# EAGLE design Proto_V1 (EAGLE 9.5.0)
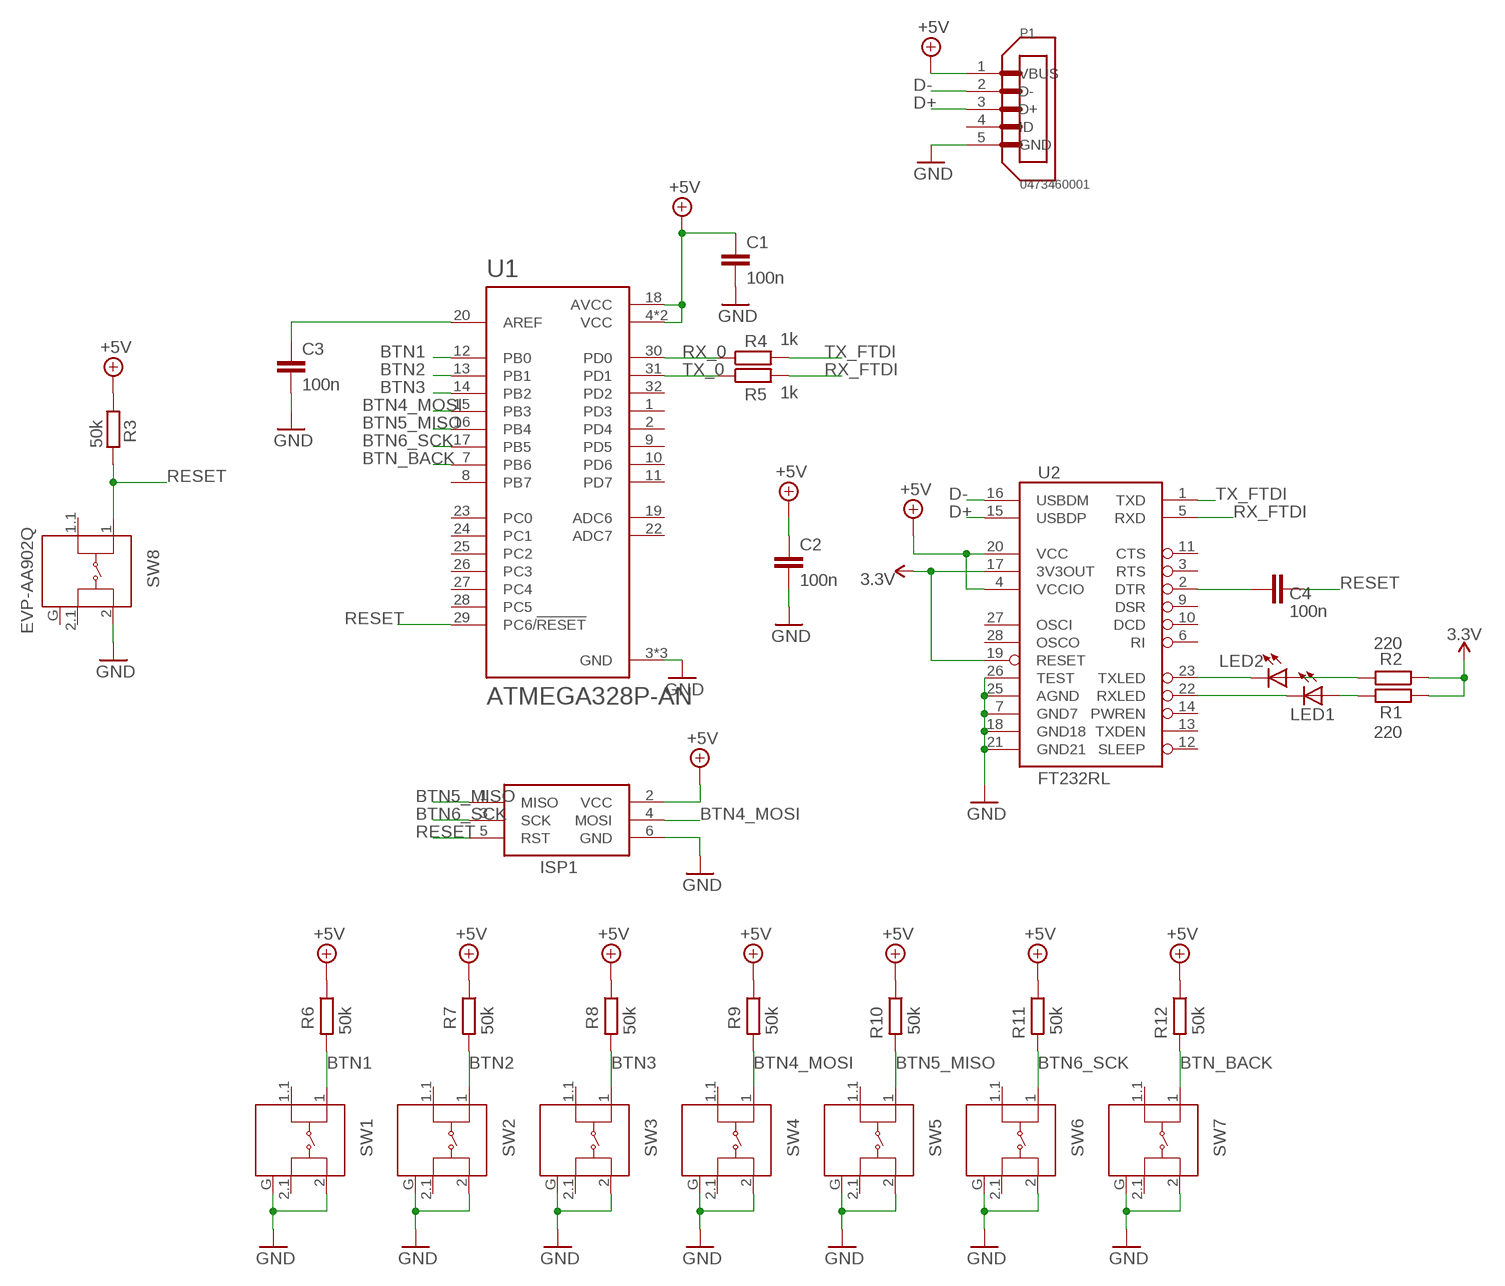
[diagram p0: schematic, sheet 1]

## Parts
C1  100n  CC0805KRX7R9BB104  [CAP_0805]
C2  100n  CC0805KRX7R9BB104  [CAP_0805]
C3  100n  CC0805KRX7R9BB104  [CAP_0805]
C4  100n  CC0805KRX7R9BB104  [CAP_0805]
ISP1  AVRISP-6  [AVRISP]
LED1  LEDCHIP-LED0805  [CHIP-LED0805]
LED2  LEDCHIP-LED0805  [CHIP-LED0805]
P1  0473460001  [MOLEX_0473460001]
R1  220  R-EU_R0805  [R0805]
R2  220  R-EU_R0805  [R0805]
R3  50k  R-EU_R0805  [R0805]
R4  1k  R-EU_R0805  [R0805]
R5  1k  R-EU_R0805  [R0805]
R6  50k  R-EU_R0805  [R0805]
R7  50k  R-EU_R0805  [R0805]
R8  50k  R-EU_R0805  [R0805]
R9  50k  R-EU_R0805  [R0805]
R10  50k  R-EU_R0805  [R0805]
R11  50k  R-EU_R0805  [R0805]
R12  50k  R-EU_R0805  [R0805]
SW1  EVP-AA902Q  [EVP-AA902Q]
SW2  EVP-AA902Q  [EVP-AA902Q]
SW3  EVP-AA902Q  [EVP-AA902Q]
SW4  EVP-AA902Q  [EVP-AA902Q]
SW5  EVP-AA902Q  [EVP-AA902Q]
SW6  EVP-AA902Q  [EVP-AA902Q]
SW7  EVP-AA902Q  [EVP-AA902Q]
SW8  EVP-AA902Q  [EVP-AA902Q]
U1  ATMEGA328P-AN  [QFP80P900X900X120-32N]
U2  FT232RL  FT232RLSSOP  [SSOP28DB]

## Nets
3.3V: R1.1 R2.1 U2.17(3V3OUT) U2.19(RESET)
+5V: C1.1 C2.1 ISP1.2(VCC) P1.1(VBUS) R3.1 R6.1 R7.1 R8.1 R9.1 R10.1 R11.1 R12.1 U1.4(VCC) U1.6(VCC) U1.18(AVCC) U2.4(VCCIO) U2.20(VCC)
BTN1: R6.2 SW1.1 U1.12(PB0)
BTN2: R7.2 SW2.1 U1.13(PB1)
BTN3: R8.2 SW3.1 U1.14(PB2)
BTN4_MOSI: ISP1.4(MOSI) R9.2 SW4.1 U1.15(PB3)
BTN5_MISO: ISP1.1(MISO) R10.2 SW5.1 U1.16(PB4)
BTN6_SCK: ISP1.3(SCK) R11.2 SW6.1 U1.17(PB5)
BTN_BACK: R12.2 SW7.1 U1.7(PB6)
D+: P1.3(D+) U2.15(USBDP)
D-: P1.2(D-) U2.16(USBDM)
GND: C1.2 C2.2 C3.2 ISP1.6(GND) P1.5(GND) SW1.2 SW1.G(SHIELD) SW2.2 SW2.G(SHIELD) SW3.2 SW3.G(SHIELD) SW4.2 SW4.G(SHIELD) SW5.2 SW5.G(SHIELD) SW6.2 SW6.G(SHIELD) SW7.2 SW7.G(SHIELD) SW8.2 U1.3(GND) U1.5(GND) U1.21(GND) U2.7(GND7) U2.18(GND18) U2.21(GND21) U2.25(AGND) U2.26(TEST)
N$1: LED1.A R1.2
N$2: LED2.C U2.23(TXLED)
N$3: LED1.C U2.22(RXLED)
N$4: LED2.A R2.2
N$5: C4.2 U2.2(DTR)
N$6: C3.1 U1.20(AREF)
RESET: C4.1 ISP1.5(RST) R3.2 SW8.1 U1.29(PC6/!RESET)
RX_0: R4.1 U1.30(PD0)
RX_FTDI: R5.2 U2.5(RXD)
TX_0: R5.1 U1.31(PD1)
TX_FTDI: R4.2 U2.1(TXD)
Unconnected: P1.4(ID) SW1.1.1 SW1.2.1 SW2.1.1 SW2.2.1 SW3.1.1 SW3.2.1 SW4.1.1 SW4.2.1 SW5.1.1 SW5.2.1 SW6.1.1 SW6.2.1 SW7.1.1 SW7.2.1 SW8.1.1 SW8.2.1 SW8.G(SHIELD) U1.1(PD3) U1.2(PD4) U1.8(PB7) U1.9(PD5) U1.10(PD6) U1.11(PD7) U1.19(ADC6) U1.22(ADC7) U1.23(PC0) U1.24(PC1) U1.25(PC2) U1.26(PC3) U1.27(PC4) U1.28(PC5) U1.32(PD2) U2.3(RTS) U2.6(RI) U2.9(DSR) U2.10(DCD) U2.11(CTS) U2.12(SLEEP) U2.13(TXDEN) U2.14(PWREN) U2.27(OSCI) U2.28(OSCO)

## Library data of the parts
C1-C4 = Resistor_Capacitor:CC0805KRX7R9BB104: CAP CER 0.1UF 50V X7R 0805 Manufacturer's datasheet <http://www.yageo.com/documents/recent/UPY-GPHC_X7R_6.3V-to-50V_18.pdf>; CREATED_BY: PCBLayout.com; DIGIKEY_PART_NUMBER: 311-1140-2-ND; MANUFACTURER: Yageo; MPN: CC0805KRX7R9BB104; PACKAGE: SMD 0805
ISP1 = adafruit:AVRISP: AVR ISP HEADER Standard 6 pin header for AVR programming
LED1 LED2 = Fidget Spinner Example:LED: LED OSRAM: - CHIPLED LG R971, LG N971, LY N971, LG Q971, LY Q971, LO R971, LY R971 LH N974, LH R974 LS Q976, LO Q976, LY Q976 LO Q996 - Hyper CHIPLED LW Q18S LB Q993, LB Q99A, LB R99A - SideLED LS A670, LO A670, LY A670, LG A670, LP A670 LB A673, LV A673, LT A673, LW A673 LH A674 LY A675 LS A676, LA A676, LO A676, LY A676, LW A676 LS A679, LY A679, LG A679 - Hyper Micro SIDELED® LS Y876, LA Y876, LO Y876, LY Y876 LT Y87S - SmartLED LW L88C, LW L88S LB L89C, LB L89S, LG L890 LS L89K, LO L89K, LY L89K LS L896, LA L896, LO L896, LY L896 - TOPLED LS T670, LO T670, LY T670, LG T670, LP T670 LSG T670, LSP T670, LSY T670, LOP T670, LYG T670 LG T671, LOG T671, LSG T671 LB T673, LV T673, LT T673, LW T673 LH T674 LS T676, LA T676, LO T676, LY T676, LB T676, LH T676, LSB T676, LW T676 LB T67C, LV T67C, LT T67C, LS T67K, LO T67K, LY T67K, LW E67C LS E67B, LA E67B, LO E67B, LY E67B, LB E67C, LV E67C, LT E67C LW T67C LS T679, LY T679, LG T679 LS T770, LO T770, LY T770, LG T770, LP T770 LB T773, LV T773, LT T773, LW T773 LH T774 LS E675, LA E675, LY E675, LS T675 LS T776, LA T776, LO T776, LY T776, LB T776 LHGB T686 LT T68C, LB T68C - Hyper Mini TOPLED® LB M676 - Mini TOPLED Santana® LG M470 LS M47K, LO M47K, LY M47K Source: http://www.osram.convergy.de LUXEON: - LUMILED® LXK2-PW12-R00, LXK2-PW12-S00, LXK2-PW14-U00, LXK2-PW14-V00 LXK2-PM12-R00, LXK2-PM12-S00, LXK2-PM14-U00 LXK2-PE12-Q00, LXK2-PE12-R00, LXK2-PE12-S00, LXK2-PE14-T00, LXK2-PE14-U00 LXK2-PB12-K00, LXK2-PB12-L00, LXK2-PB12-M00, LXK2-PB14-N00, LXK2-PB14-P00, LXK2-PB14-Q00 LXK2-PR12-L00, LXK2-PR12-M00, LXK2-PR14-Q00, LXK2-PR14-R00 LXK2-PD12-Q00, LXK2-PD12-R00, LXK2-PD12-S00 LXK2-PH12-R00, LXK2-PH12-S00 LXK2-PL12-P00, LXK2-PL12-Q00, LXK2-PL12-R00 Source: www.luxeon.com KINGBRIGHT: KA-3528ASYC Source: www.kingbright.com
P1 = 0473460001:0473460001: Conn Micro USB Type B RCP 5 POS 0.65mm Solder RA SMD 5 Terminal 1 Port T/R; AVAILABILITY: Unavailable; DESCRIPTION: Conn Micro USB Type B RCP 5 POS 0.65mm Solder RA SMD 5 Terminal 1 Port T/R; MF: Weidmuller; MP: 0473460001; PACKAGE: None; PRICE: None
R1-R12 = resistor:R-EU_: RESISTOR, European symbol
SW1-SW8 = Switch:EVP-AA902Q: SWITCH TACTILE SPST-NO 0.02A 15V Manufacturer's datasheet <https://industrial.panasonic.com/ac/cdn/e/control/switch/light-touch/catalog/sw_lt_eng_3529s.pdf>; CREATED_BY: PCBLayout.com; DIGIKEY_PARTNO: P15193TR-ND; MANUFACTURER: Panasonic Electronic Components; MPN: EVP-AA902Q
U1 = ATMEGA328P-AN:ATMEGA328P-AN: ATmega Series 20 MHz 32 KB Flash 2 KB SRAM 8-Bit Microcontroller - TQFP-32; AVAILABILITY: Unavailable; DESCRIPTION: MCU 8-bit ATmega AVR RISC 32KB Flash 2.5V/3.3V/5V 32-Pin TQFP Tray; MF: Microchip; MP: ATMEGA328P-AN; PACKAGE: TQFP-32 Microchip; PRICE: None
U2 = SparkFun-IC-Comms:FT232RL: FT232RL USB UART FT232RL 4th Generation USB UART (USB <-> Serial) Controller. Datasheet <http://www.sparkfun.com/datasheets/IC/FT232R_v104.pdf> SparkFun Products Component <https://www.sparkfun.com/products/650> (COM-00650) SparkFun RedBot Mainboard <https://www.sparkfun.com/products/12097> (ROB-12097) SparkFun FTDI Basic Breakout - 5V <https://www.sparkfun.com/products/9716> (DEV-09716) SparkFun FTDI Basic Breakout - 3.3V <https://www.sparkfun.com/products/9873> (DEV-09873) Bus Pirate - v3.6a <https://www.sparkfun.com/products/12942> (TOL-12942) SparkFun USB to Serial Breakout - FT232RL <https://www.sparkfun.com/products/12731> (BOB-12731) SparkFun PicoBoard <https://www.sparkfun.com/products/11888> (WIG-11888) SparkFun RFID USB Reader <https://www.sparkfun.com/products/9963> (SEN-09963) LilyPad FTDI Basic Breakout - 5V <https://www.sparkfun.com/products/10275> (DEV-10275) SparkFun Stepoko <https://www.sparkfun.com/products/13899> (ROB-13899); PROD_ID: IC-00870

## Board
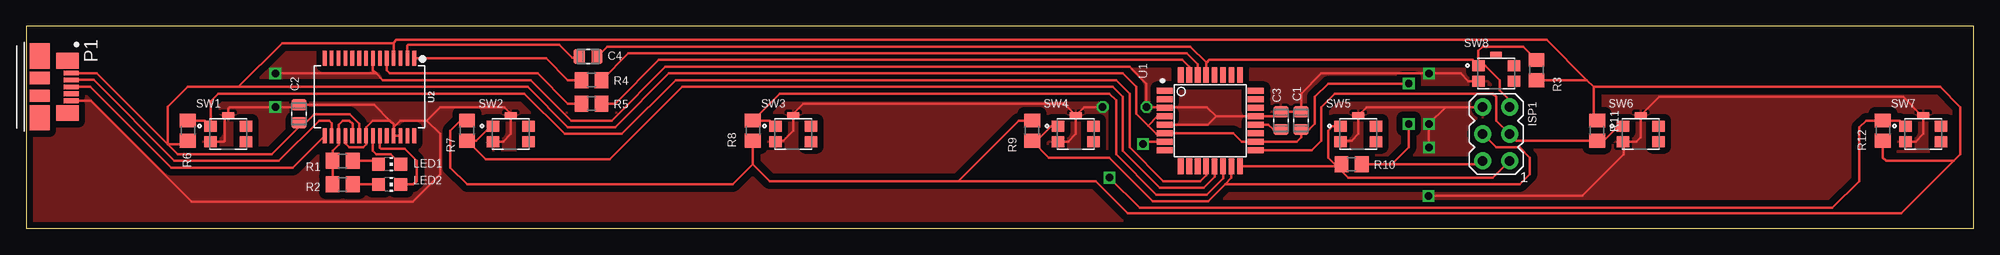
[diagram p1: board, top side]
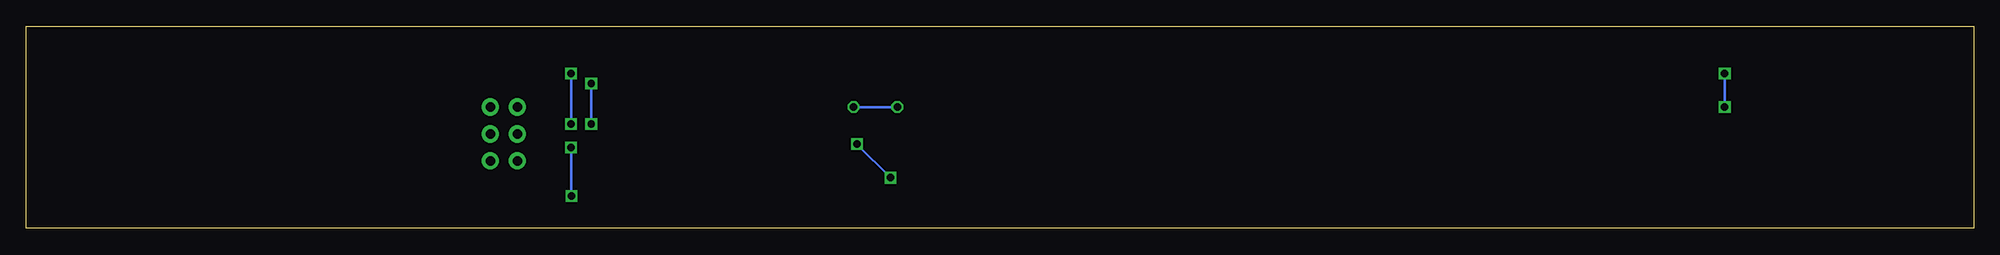
[diagram p2: board, bottom side, seen from below]

Size 183.81 x 19.04 mm. Coordinates in mm from the lower left corner, seen from the top.
Outline: 0,0 183.81,0 183.81,19.04 0,19.04 0,0
Copper layers (1*16): Top 0.035mm / dielectric 1.5mm / Bottom 0.035mm
Design rules "default *": minimum track width 6mil, minimum drill 0.35mm, track to track 6mil, track to pad 6mil, pad to pad 6mil, via to via 6mil, smd to smd 6mil, copper to edge 10mil, drill to drill 6mil, minimum pad ring 10mil, minimum via ring 8mil, stop-mask expansion 4mil, vias tented up to drill 0mil, thermal gap 10mil

### Footprints (pad centres in the part's own frame; a part is rotated, then mirrored left to right if it is on the bottom)
CAP_0805 = smd 1.05 x 1.38: 1 -0.84,0; 2 0.84,0
AVRISP = drill 0.9 pad 1.626: 1 -1.27,2.54; 2 1.27,2.54; 3 -1.27,0; 4 1.27,0; 5 -1.27,-2.54; 6 1.27,-2.54
CHIP-LED0805 = smd 1.2 x 1.2: A 0,-1.05; C 0,1.05
MOLEX_0473460001 = smd 0.45 x 1.38: 1 -1.3,0; 2 -0.65,0; 3 0,0; 4 0.65,0; 5 1.3,0 | smd 1.475 x 2.1: P1 -2.462,-0.36; P2 2.462,-0.36 | smd 2.375 x 1.9: P3 -2.913,-2.99; P6 2.913,-2.99 | smd 1.175 x 1.9: P4 -0.838,-2.99; P5 0.838,-2.99
R0805 = smd 1.3 x 1.5: 1 -0.95,0; 2 0.95,0
EVP-AA902Q = smd 1.15 x 1.05: 1 -1.675,0.725; 1.1 1.675,0.725; 2 -1.675,-0.725; 2.1 1.675,-0.725 | smd 1.1 x 0.6: G 0,1.75
QFP80P900X900X120-32N = smd 1.5 x 0.55: 1 -4.3,2.8; 2 -4.3,2; 3 -4.3,1.2; 4 -4.3,0.4; 5 -4.3,-0.4; 6 -4.3,-1.2; 7 -4.3,-2; 8 -4.3,-2.8; 17 4.3,-2.8; 18 4.3,-2; 19 4.3,-1.2; 20 4.3,-0.4; 21 4.3,0.4; 22 4.3,1.2; 23 4.3,2; 24 4.3,2.8 | smd 0.55 x 1.5: 9 -2.8,-4.3; 10 -2,-4.3; 11 -1.2,-4.3; 12 -0.4,-4.3; 13 0.4,-4.3; 14 1.2,-4.3; 15 2,-4.3; 16 2.8,-4.3; 25 2.8,4.3; 26 2,4.3; 27 1.2,4.3; 28 0.4,4.3; 29 -0.4,4.3; 30 -1.2,4.3; 31 -2,4.3; 32 -2.8,4.3
SSOP28DB = smd 0.348 x 1.397: 1 -4.225,-3.656; 2 -3.575,-3.656; 3 -2.925,-3.656; 4 -2.275,-3.656; 5 -1.625,-3.656; 6 -0.975,-3.656; 7 -0.325,-3.656; 8 0.325,-3.656; 9 0.975,-3.656; 10 1.625,-3.656; 11 2.275,-3.656; 12 2.925,-3.656; 13 3.575,-3.656; 14 4.225,-3.656; 15 4.225,3.656; 16 3.575,3.656; 17 2.925,3.656; 18 2.275,3.656; 19 1.625,3.656; 20 0.975,3.656; 21 0.325,3.656; 22 -0.325,3.656; 23 -0.975,3.656; 24 -1.625,3.656; 25 -2.275,3.656; 26 -2.925,3.656; 27 -3.575,3.656; 28 -4.225,3.656

### Placement (x,y rotation side)
C1  120.33,10.16 90 top
C2  25.72,10.79 90 top
C3  118.43,10.16 90 top
C4  53.02,16.19 180 top
ISP1  138.75,8.89 180 top
LED1  34.29,6.03 270 top
LED2  34.29,4.13 270 top
P1  4.23,13.33 270 top
R1  29.84,6.35 0 top
R2  29.84,4.13 0 top
R3  142.56,14.92 90 top
R4  53.34,13.97 180 top
R5  53.34,11.75 180 top
R6  15.24,9.21 90 top
R7  41.59,9.21 270 top
R8  68.58,9.21 90 top
R9  94.93,9.21 270 top
R10  125.09,6.03 180 top
R11  148.27,9.21 270 top
R12  175.26,9.21 90 top
SW1  19.05,8.89 0 top
SW2  45.72,8.89 0 top
SW3  72.39,8.89 0 top
SW4  99.06,8.89 0 top
SW5  125.73,8.89 0 top
SW6  152.4,8.89 0 top
SW7  179.07,8.89 0 top
SW8  138.75,14.61 0 top
U1  111.76,10.16 0 top
U2  32.38,12.38 180 top

### Tracks (layer width: path | path; a pad name or v marks a point on that pad's centre or on a via)
3.3V
  Top 0.254: R2.1 R1.1 28.89,7.3 29.46,7.87 U2.17 29.46,9.78 29.84,10.16 30.48,10.16 30.8,9.84 30.8,8.76 U2.19
+5V  (via drill 0.7)
  Top 0.254: U2.20 31.43,8.75 31.43,9.84 30.5,10.77 27.17,10.77 26.35,9.96 C2.1 25.72,9.53 23.18,6.98 14.29,6.98 13.34,7.94 | P1.1 6.64,14.63 13.34,7.94 | 105.89,9.68 104.78,10.79 104.78,13.33 103.5,14.61 60.64,14.61 55.56,9.53 51.12,9.53 47.31,13.33 20,13.33 | 105.89,9.68 106.68,8.89 107.39,8.89 U1.6 113.91,8.96 114.71,8.16 U1.18 119.92,8.16 120.33,8.57 C1.1 121.08,9.32 121.6,9.84 121.6,12.38 122.87,13.65 v130.49,13.65 | 34.66,17.52 U2.4 | 34.66,17.52 34.92,17.78 143.51,17.78 147.32,13.97 | 181.93,6.35 182.56,6.98 182.56,11.43 180.66,13.33 147.96,13.33 | 181.93,6.35 175.58,6.35 175.26,6.67 R12.1 | R3.1 147.32,13.97 | 147.32,13.97 147.96,13.33 | ISP1.2 137.16,6.03 128.91,6.03 | 128.91,6.03 R10.1 | 147.96,13.33 147.96,10.47 R11.1 | 68.58,6.03 66.67,4.13 41.59,4.13 40.01,5.71 40.01,9.21 40.95,10.16 R7.1 | R8.1 68.58,6.03 | 68.58,6.03 70.17,4.45 87.95,4.45 | R9.1 93.67,10.16 93.66,10.16 87.95,4.45 | 87.95,4.45 100.97,4.45 103.98,1.43 177.01,1.43 181.93,6.35 | 20,13.33 15.21,13.33 13.34,11.46 13.34,7.94 | R6.1 14.92,7.94 13.34,7.94 | v130.49,9.84 130.49,7.62 128.91,6.03 | 20,13.33 24.13,17.46 34.61,17.46 34.66,17.52 | 105.89,9.68 106.76,10.56 U1.4
  Bottom 0.254: v130.49,13.65 v130.49,9.84
BTN1
  Top 0.254: U1.12 111.36,5 110.81,4.45 107.31,4.45 104.14,7.62 104.14,12.7 102.87,13.97 61.28,13.97 56.2,8.89 50.8,8.89 46.99,12.7 18.1,12.7 17.38,11.98 SW1.1 16.83,10.16 R6.2
BTN2
  Top 0.254: U1.13 112.16,4.85 111.12,3.81 107,3.81 103.5,7.3 103.5,12.38 102.55,13.33 61.91,13.33 55.09,6.51 43.34,6.51 R7.2 42.46,8.26 43.81,9.62 SW2.1
BTN3
  Top 0.254: U1.14 112.96,4.69 111.44,3.17 106.68,3.17 102.87,6.98 102.87,12.06 102.23,12.7 71.12,12.7 R8.2 70.17,10.16 SW3.1
BTN4_MOSI
  Top 0.254: U1.15 113.76,4.74 113.16,4.14 | SW4.1 96.75,9.62 95.39,8.26 R9.2 96.52,6.67 102.23,6.67 106.35,2.55 111.57,2.55 113.16,4.14 | ISP1.4 138.75,7.62 140.97,7.62 141.92,6.67 141.92,5.08 140.98,4.14 130.5,4.14 130.49,4.13 113.16,4.14
BTN5_MISO
  Top 0.254: SW5.1 123.28,9.62 122.87,9.21 122.87,6.67 123.68,5.86 | 123.68,5.86 123.97,5.86 R10.2 124.14,5.39 124.78,4.76 138.43,4.76 ISP1.1 | U1.16 123.68,5.86
BTN6_SCK
  Top 0.254: U1.17 121.34,7.36 122.24,8.26 122.24,11.43 123.51,12.7 138.43,12.7 138.75,12.38 138.75,10.16 ISP1.3 140.65,8.26 R11.2 148.91,8.26 150.26,9.62 SW6.1
BTN_BACK  (via drill 0.7)
  Top 0.254: SW7.1 176.85,10.16 R12.2 173.67,10.16 173.04,9.53 173.04,4.45 170.5,1.91 105.09,1.91 v102.23,4.76 | U1.7 105.63,8.16 v105.41,7.94
  Bottom 0.254: v102.23,4.76 v105.41,7.94
D+
  Top 0.254: P1.3 6.03,13.33 13.65,5.71 25.15,5.71 U2.15
D-
  Top 0.254: P1.2 6.33,13.98 13.97,6.35 23.81,6.35 27.62,10.16 28.57,10.16 28.81,9.92 U2.16
GND  (via drill 0.7, 0.7 pad 0.75)
  Top 0.254: P1.5 6.06,12.04 15.58,2.51 36.49,2.51 39.05,5.08 39.05,8.89 37.78,10.16 | 112.31,10.56 U1.21 117.99,10.56 C3.2 C1.2 120.33,12.7 122.24,14.61 v132.4,14.61 135.4,14.61 136.12,13.88 SW8.2 | U1.5 111.51,9.76 112.31,10.56 | 34.29,10.16 32.7,10.16 32.06,9.52 U2.21 32.07,7.94 31.78,7.65 30.48,7.65 30.16,7.96 30.16,8.67 U2.18 | 34.66,9.53 34.66,9.79 34.29,10.16 | 34.66,9.53 U2.25 U2.26 | 37.78,10.16 35.3,10.16 34.66,9.53 | SW5.2 124.14,8.26 125.09,8.26 125.73,8.89 SW5.G 126.52,11.43 133.99,11.43 | ISP1.6 133.99,11.43 | 34.29,10.16 32.81,11.63 C2.2 25.51,11.43 v23.5,11.43 19.2,11.43 19.05,11.28 SW1.G 18.73,10.32 18.73,8.26 18.64,8.16 SW1.2 | 33.02,14.61 32.7,14.92 U2.7 | SW3.2 70.81,8.26 71.44,8.26 72.39,9.21 SW3.G 72.39,10.79 73.34,11.75 97.95,11.75 SW4.G | SW7.G 179.07,10.48 | 179.07,10.48 179.07,8.89 178.34,8.16 SW7.2 | SW4.2 98.33,8.16 99.06,8.89 SW4.G | SW2.2 44.99,8.16 45.72,8.89 SW2.G 45.56,10.79 45.56,10.95 45.09,11.43 39.05,11.43 37.78,10.16 | 179.07,10.48 177.16,12.38 154.14,12.38 SW6.G 152.4,8.57 151.99,8.16 SW6.2 150.81,8.08 150.81,6.98 146.86,3.04 v132.37,3.04 | SW4.G 99.85,11.43 v101.6,11.43 | 133.99,11.43 v132.4,9.84 v132.4,7.62 | v23.5,14.61 33.02,14.61 | 33.02,14.61 33.66,13.97 47.62,13.97 51.44,10.16 55.24,10.16 60.33,15.24 104.14,15.24 105.73,13.65 v105.73,11.43 107.39,11.43 | 107.39,11.43 U1.3 | 107.39,11.43 111.44,11.43 112.31,10.56
  Bottom 0.254: v105.73,11.43 v101.6,11.43 | v132.4,14.61 v132.4,9.84 | v132.4,7.62 132.37,7.6 v132.37,3.04 | v23.5,14.61 v23.5,11.43
  pour Top (isolate 0.61): 0,19.05 0,0 183.83,0 183.83,19.05
N$1
  Top 0.254: LED1.A 32.92,6.35 R1.2
N$2
  Top 0.254: LED2.C 36.51,4.13 36.83,4.45 36.83,6.35 35.7,7.48 33.48,7.48 33.36,7.6 U2.23
N$3
  Top 0.254: LED1.C 34.39,6.98 33.02,6.98 32.71,7.29 U2.22
N$4
  Top 0.254: LED2.A R2.2
N$5
  Top 0.254: U2.2 35.96,17.23 36.04,17.31 50.32,17.31 51.55,16.08 52.07,16.08 C4.2
N$6
  Top 0.254: U1.20 117.24,9.76 117.68,9.32 C3.1
RESET
  Top 0.254: U1.29 111.36,15.56 | ISP1.5 140.02,12.06 139.06,13.02 139.06,13.97 137.71,15.33 SW8.1 | SW8.1 136.53,15.88 111.68,15.88 111.36,15.56 | C4.1 54.81,17.14 109.86,17.14 111.36,15.64 111.36,15.56 | SW8.1 137.07,16.74 137.48,17.14 141.29,17.14 R3.2
RX_0
  Top 0.254: U1.30 110.56,15.49 109.54,16.51 56.83,16.51 R4.1
RX_FTDI
  Top 0.254: U2.5 34.01,14.88 34.29,14.61 48.26,14.61 51.12,11.75 R5.2
TX_0
  Top 0.254: U1.31 109.76,15.24 109.12,15.88 59.69,15.88 55.56,11.75 R5.1
TX_FTDI
  Top 0.254: U2.1 49.05,16.04 51.12,13.97 R4.2